# Altium schematic sheet SH2 - 48V POWER.SchDoc: Load Monitoring 1
size B; CheckedBy: Cindy Li; Engineer: Farris Matar; Organization: UW Robotics; Address1: 200 University Avenue; Address2: Waterloo; Address3: Ontario; Address4: Canada N2L 3G6; DocumentNumber: 5; Revision: 3; SheetNumber: 5; SheetTotal: 9
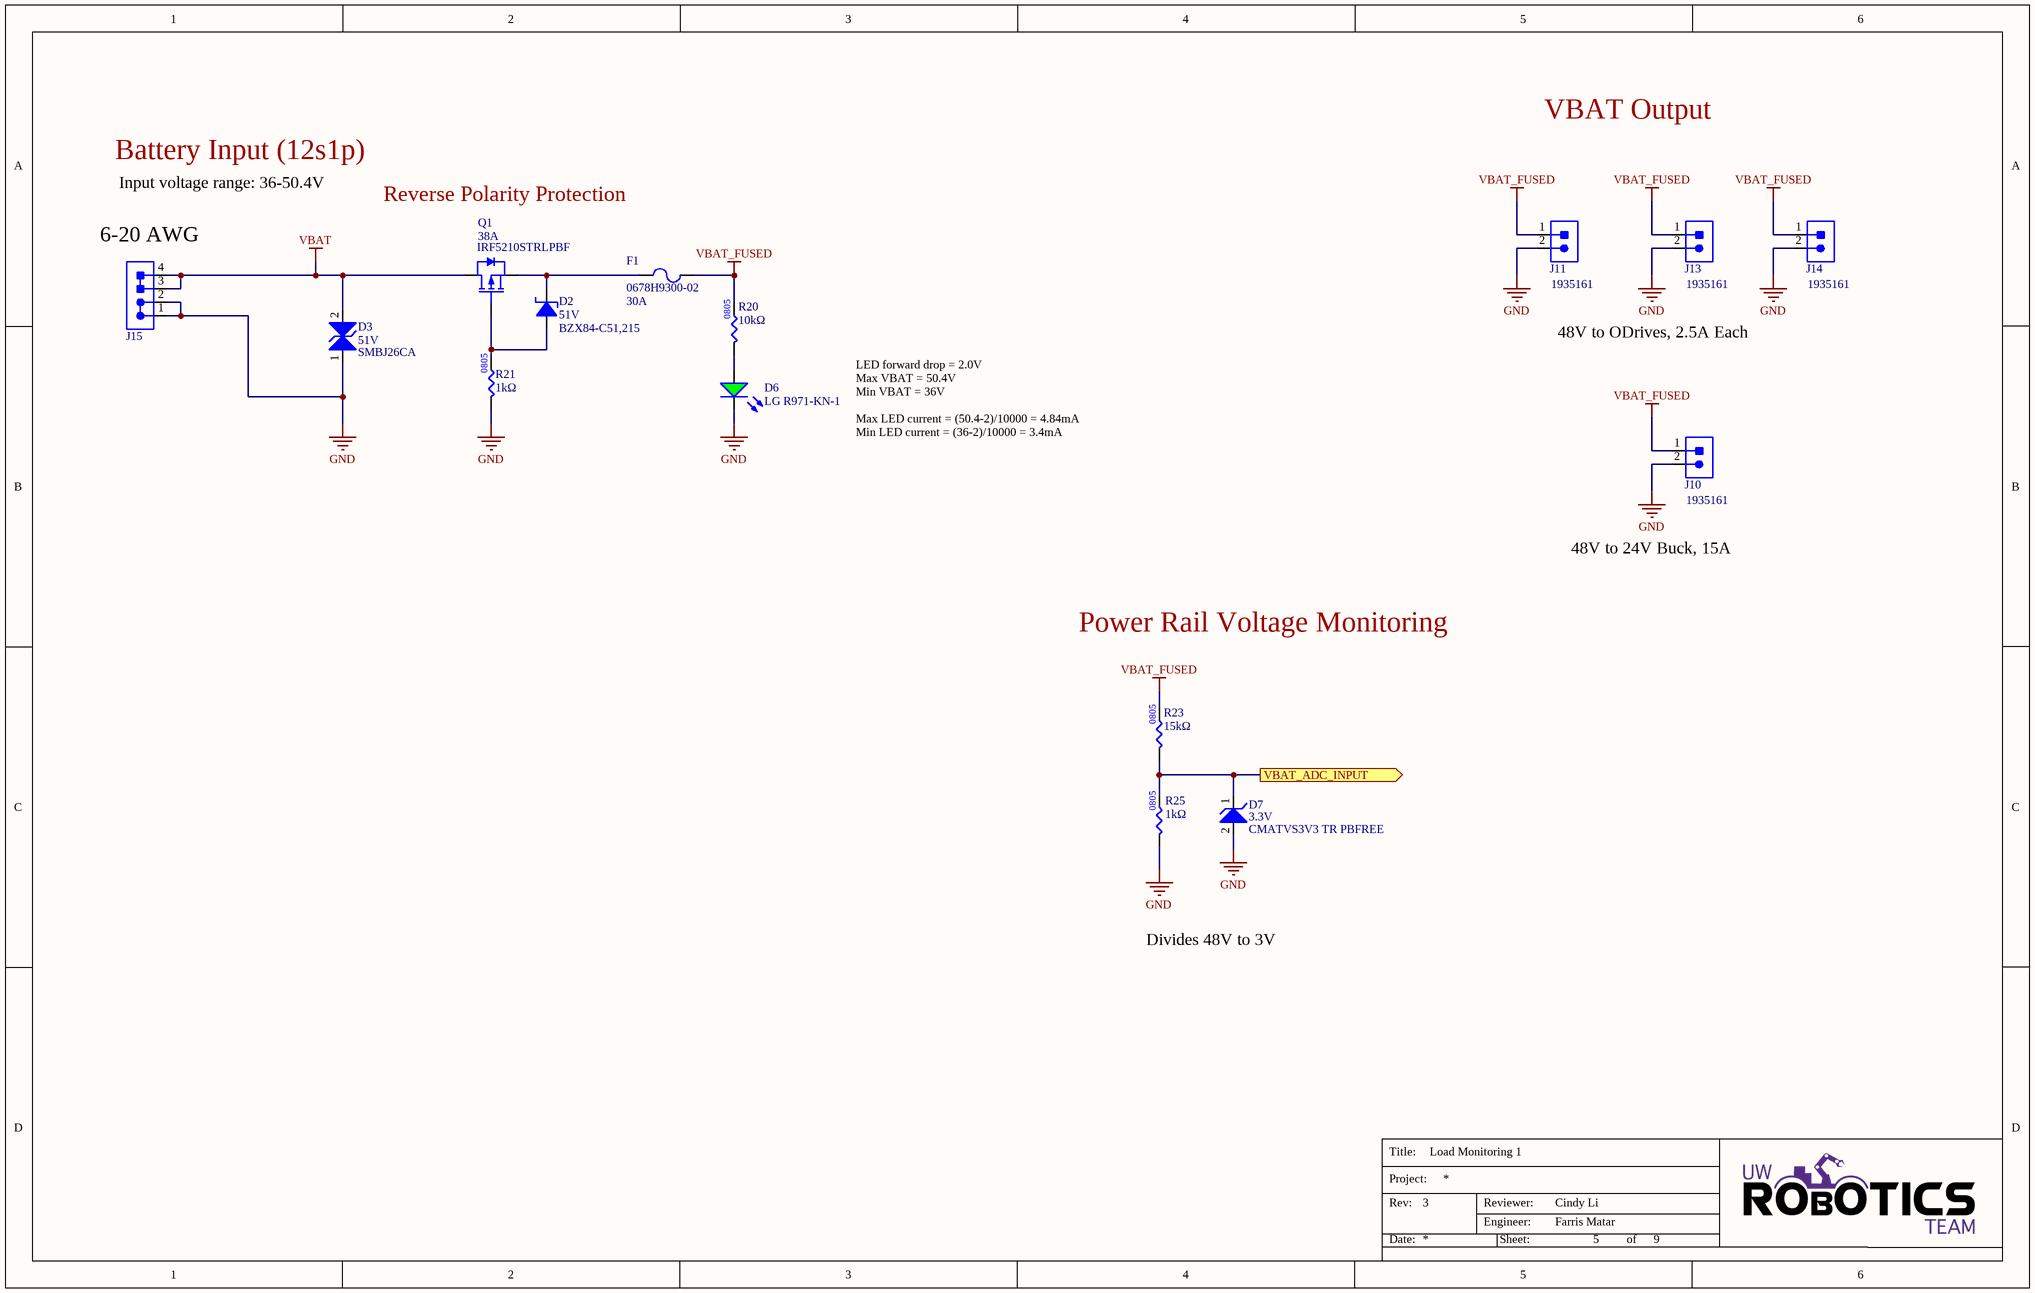
[diagram p0: SH2 - 48V POWER.SchDoc]

## Parts
D2  Manufacturer Part Number 1: BZX84-C51,215  Working Voltage: 51V  [SOT23-3]  (hidden comment: DIO_ZENER_51V)
D3  Manufacturer Part Number 1: SMBJ26CA  Voltage - Reverse Standoff (Typ): 51V  [TVS_DIODE_BIDIR_SMB]  (hidden comment: TVS_DIODE_BIDIR_51V)
D6  Manufacturer Part Number 1: LG R971-KN-1  [LED_0805_GREEN]  (hidden comment: LED_GREEN)
D7  Manufacturer Part Number 1: CMATVS3V3 TR PBFREE  Voltage - Reverse Standoff (Typ): 3.3V  [SOD-923]  (hidden comment: TVS_DIODE_UNIDIR_3.3V_7A)
F1  Manufacturer Part Number 1: 0678H9300-02  Current Rating: 30A  [FUSE_3912]  (hidden comment: FUSE_30A_3912)
J10  CON_2M_TERM  [1935161]  (value not drawn)
J11  CON_2M_TERM  [1935161]  (value not drawn)
J13  CON_2M_TERM  [1935161]  (value not drawn)
J14  CON_2M_TERM  [1935161]  (value not drawn)
J15  CON_2POS_SCREW_TERM  [VP0265540000G]  (value not drawn)
Q1  Current - Continous Drain: 38A  Manufacturer Part Number 1: IRF5210STRLPBF  [DPAK254P1524X483-4_3N - new]  (hidden comment: PMOS_100V_38A)
R20  value 10kΩ  [RES0805]  (hidden comment: RES_10kΩ_0805_5%)
R21  value 1kΩ  [RES0805]  (hidden comment: RES_1kΩ_0805_1%)
R23  value 15kΩ  [RES0805]  (hidden comment: RES_15kΩ_0805_1%)
R25  value 1kΩ  [RES0805]  (hidden comment: RES_1kΩ_0805_1%_1)

## Ports
VBAT_ADC_INPUT (out)

## Nets
GND: D3.1 D6.2(K) D7.2 J10.2 J11.2 J13.2 J14.2 J15.1 J15.2 R21.1 R25.1
VBAT: D3.2 J15.3 J15.4 Q1.2(Drain)
VBAT_FUSED: F1.2 J10.1 J11.1 J13.1 J14.1 R20.2 R23.2
VBAT_ADC_INPUT: D7.1 R23.1 R25.2 ; port VBAT_ADC_INPUT
NetD2_1: D2.1(Anode) Q1.1(Gate) R21.2
NetD2_3: D2.3(Cathode) F1.1 Q1.3(Source)
NetD6_1: D6.1(A) R20.1

## Notes on the sheet
- Battery Input (12s1p)
- VBAT Output
- Input voltage range: 36-50.4V
- Reverse Polarity Protection
- (near J15) 6-20 AWG
- 48V to ODrives, 2.5A Each
- LED forward drop = 2.0V
  Max VBAT = 50.4V
  Min VBAT = 36V
  Max LED current = (50.4-2)/10000 = 4.84mA
  Min LED current = (36-2)/10000 = 3.4mA
- 48V to 24V Buck, 15A
- Power Rail Voltage Monitoring
- Divides 48V to 3V
- Title:
- Project:
- Date:
- Rev:
- Reviewer:
- Engineer:
- Sheet:
- of
- (in symbol RES_15kΩ_0805_1%) 0805

## Library data of the parts
D2 = DIO_ZENER_51V: DIODE ZENER 51V 250MW TO236AB; Manufacturer 1: Nexperia USA Inc.; Forward Voltage: 0.9V; Supplier Part Number 1: 1727-5037-1-ND; Supplier 1: Digi-Key; Package/Case: SOT-23-3
D3 = TVS_DIODE_BIDIR_51V: TVS DIODE 51VWM 82.4VC DO214AA; Manufacturer 1: Littelfuse; Package/Footprint: SMB; Voltage - Clamping (Max) @ Ipp: 82.4V; Voltage - Breakdown (Min): 56.7V; Mounting Type: SMD; Supplier 1: Digi-Key; Supplier Part Number 1: SMBJ51CALFCT-ND; Supplier 2: Digi-Key; Supplier Part Number 2: SMBJ51CA-FDIDKR-ND
D6 = LED_GREEN: LED GREEN DIFFUSED 0805 SMD; Manufacturer 1: OSRAM; Forward Voltage Drop: 2.2V; Package/Footprint: 0805; Mounting Type: SMD; Supplier 1: Digi-Key; Supplier Part Number 1: 475-1410-1-ND; Supplier 2: Future Electronics; Supplier Part Number 2: 1152237
D7 = TVS_DIODE_UNIDIR_3.3V_7A: TVS DIODE 3.3VWM 11VC SOD923; Manufacturer 1: Central Semiconductor Corp; Voltage - Breakdown (Min): 5V; Voltage - Clamping (Max) @ Ipp: 11V; Mounting Type: SMD; Package/Footprint: SOD-923; Supplier 1: Digi-Key; Supplier Part Number 1: 1514-CMATVS3V3TRPBFREECT-ND; Supplier 2: Mouser; Supplier Part Number 2: 610-CMATVS3V3
F1 = FUSE_30A_3912: FUSE SMT 3912 ENH BRK 250V 30A; Manufacturer 1: Bel Fuse Inc.; Package/Footprint: 3912; Supplier 1: Digi-Key; Supplier Part Number 1: 507-2254-1-ND; Mounting Type: SMD; Verified: No
J10 J11 J13 J14 = CON_2M_TERM: TERM BLK 2POS SIDE ENTRY 5MM; Manufacturer 1: Phoenix Contact; Max Current Rating: 16A; Current: 18A; Voltage: 300V; Package/Footprint: SMD; Supplier 1: Digi-Key; Supplier Part Number 1: 277-1667-ND; Manufacturer Part Number 1: 1935161; Mounting Type: TH
J15 = CON_10.16M_2POS_SCREW_TERM: TERM BLK 2P SIDE ENT 10.16MM PCB; Manufacturer 1: Amphenol Anytek; Package/Footprint: TERMINAL; Supplier 1: Digi-Key; Mounting Type: TH; Supplier Part Number 1: VP0265540000G-ND; Manufacturer Part Number 1: VP0265540000G
Q1 = PMOS_100V_38A: MOSFET P-CH 100V 38A D2PAK; Manufacturer 1: Vishay Siliconix; Vgs (Max): ±15V; Id: 120A; Mounting Type: SMD; Verified: No; Vdss: 100V; Supplier 1: Digi-Key; Supplier Part Number 1: IRF5210STRLPBFCT-ND; Package/Footprint: D2Pak
R20 = RES_10kΩ_0805_5%: RES 10K OHM 5% 1/8W 0805; Manufacturer 1: Panasonic Electronic Components; Manufacturer Part Number 1: ERJ-6GEYJ103V; Package/Footprint: 0805; Supplier Part Number 1: P10KACT-ND; Supplier 1: Digi-Key; LCSC Part #: C17414; Mounting Type: SMD
R21 = RES_1kΩ_0805_1%: RES 1K OHM 1% 1/8W 0805; Manufacturer 1: Yageo; Manufacturer Part Number 1: RC0805FR-071KL; Package: 0805; Supplier Part Number 1: 311-1.00KCRCT-ND; Supplier 1: Digi-Key; Mounting Type: SMD; LCSC Part #: C17513
R23 = RES_15kΩ_0805_1%: RES 15K OHM 1% 1/8W 0805 /; Manufacturer 1: Vishay Dale; Manufacturer Part Number 1: CRCW080515K0FKEA; Supplier Part Number 1: 541-15.0KCCT-ND; Supplier 1: Digi-Key
R25 = RES_1kΩ_0805_1%_1: RES 1K OHM 1% 1/8W 0805; Manufacturer 1: Yageo; Manufacturer Part Number 1: RC0805FR-071KL; Supplier 1: Digi-Key; Supplier Part Number 1: 311-1.00KCRCT-ND; Package: 0805; Mounting Type: SMD; LCSC Part #: C17513